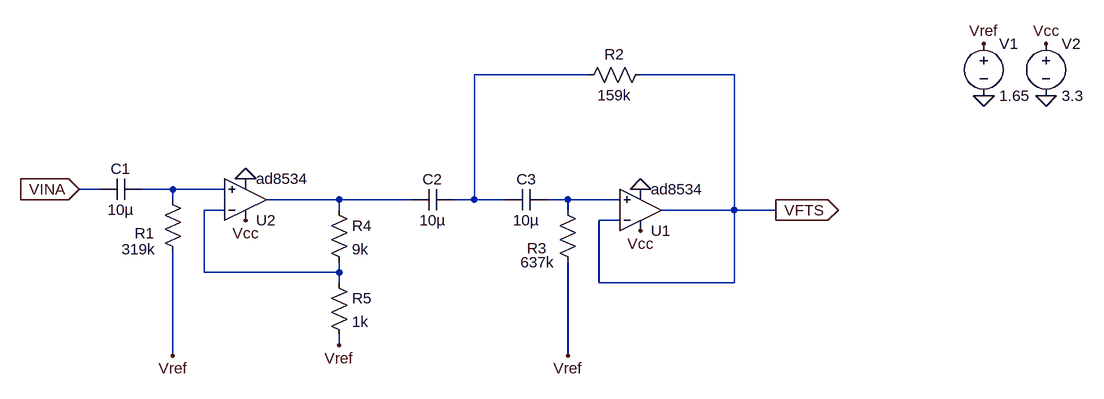
[diagram p0: schematic FTS.asc]
FTS.asc, the LTspice schematic file:
Version 4.1
SHEET 1 1164 680
WIRE 400 -64 224 -64
WIRE 624 -64 480 -64
WIRE -352 112 -384 112
WIRE -240 112 -288 112
WIRE -160 112 -240 112
WIRE -240 128 -240 112
WIRE 16 128 -96 128
WIRE 128 128 16 128
WIRE 224 128 224 -64
WIRE 224 128 192 128
WIRE 272 128 224 128
WIRE 368 128 336 128
WIRE 448 128 368 128
WIRE -160 144 -192 144
WIRE 16 144 16 128
WIRE 368 144 368 128
WIRE 624 144 624 -64
WIRE 624 144 512 144
WIRE 688 144 624 144
WIRE 448 160 416 160
WIRE -192 240 -192 144
WIRE 16 240 16 224
WIRE 16 240 -192 240
WIRE 16 256 16 240
WIRE 416 256 416 160
WIRE 624 256 624 144
WIRE 624 256 416 256
WIRE 16 352 16 336
WIRE -240 368 -240 208
WIRE 368 368 368 224
FLAG 688 144 VFTS
IOPIN 688 144 Out
FLAG -384 112 VINA
IOPIN -384 112 In
FLAG 1008 -32 0
FLAG 1008 -112 Vref
FLAG 1104 -32 0
FLAG 1104 -112 Vcc
FLAG 368 368 Vref
FLAG 480 112 0
FLAG 480 176 Vcc
FLAG -240 368 Vref
FLAG -128 96 0
FLAG -128 160 Vcc
FLAG 16 352 Vref
SYMBOL voltage 1008 -128 R0
SYMATTR InstName V1
SYMATTR Value 1.65
SYMBOL voltage 1104 -128 R0
SYMATTR InstName V2
SYMATTR Value 3.3
SYMBOL OpAmps\\opamp2 480 208 M180
SYMATTR InstName U1
SYMATTR Value ad8534
SYMBOL OpAmps\\opamp2 -128 192 M180
SYMATTR InstName U2
SYMATTR Value ad8534
SYMBOL cap -288 96 R90
WINDOW 0 0 32 VBottom 2
WINDOW 3 32 32 VTop 2
SYMATTR InstName C1
SYMATTR Value 10µ
SYMBOL res -256 112 R0
WINDOW 0 -43 68 Left 2
WINDOW 3 -63 92 Left 2
SYMATTR InstName R1
SYMATTR Value 319k
SYMBOL cap 192 112 R90
WINDOW 0 0 32 VBottom 2
WINDOW 3 32 32 VTop 2
SYMATTR InstName C2
SYMATTR Value 10µ
SYMBOL cap 336 112 R90
WINDOW 0 0 32 VBottom 2
WINDOW 3 32 32 VTop 2
SYMATTR InstName C3
SYMATTR Value 10µ
SYMBOL res 496 -80 R90
WINDOW 0 0 56 VBottom 2
WINDOW 3 32 56 VTop 2
SYMATTR InstName R2
SYMATTR Value 159k
SYMBOL res 352 128 R0
WINDOW 0 -47 75 Left 2
WINDOW 3 -57 96 Left 2
SYMATTR InstName R3
SYMATTR Value 637k
SYMBOL res 0 128 R0
SYMATTR InstName R4
SYMATTR Value 9k
SYMBOL res 0 240 R0
SYMATTR InstName R5
SYMATTR Value 1k

The netlist it stands for:
* FTS.asc
V1 Vref 0 1.65
V2 Vcc 0 3.3
X§U1 N004 VFTS Vcc 0 VFTS ad8534  ; pins In+ In- V+ V- OUT
X§U2 N002 N005 Vcc 0 N003 ad8534  ; pins In+ In- V+ V- OUT
C1 N002 VINA 10µ
R1 N002 Vref 319k
C2 N001 N003 10µ
C3 N004 N001 10µ
R2 VFTS N001 159k
R3 N004 Vref 637k
R4 N003 N005 9k
R5 N005 Vref 1k
.backanno
.end